# Altium schematic sheet Oscillating.SchDoc
size A3
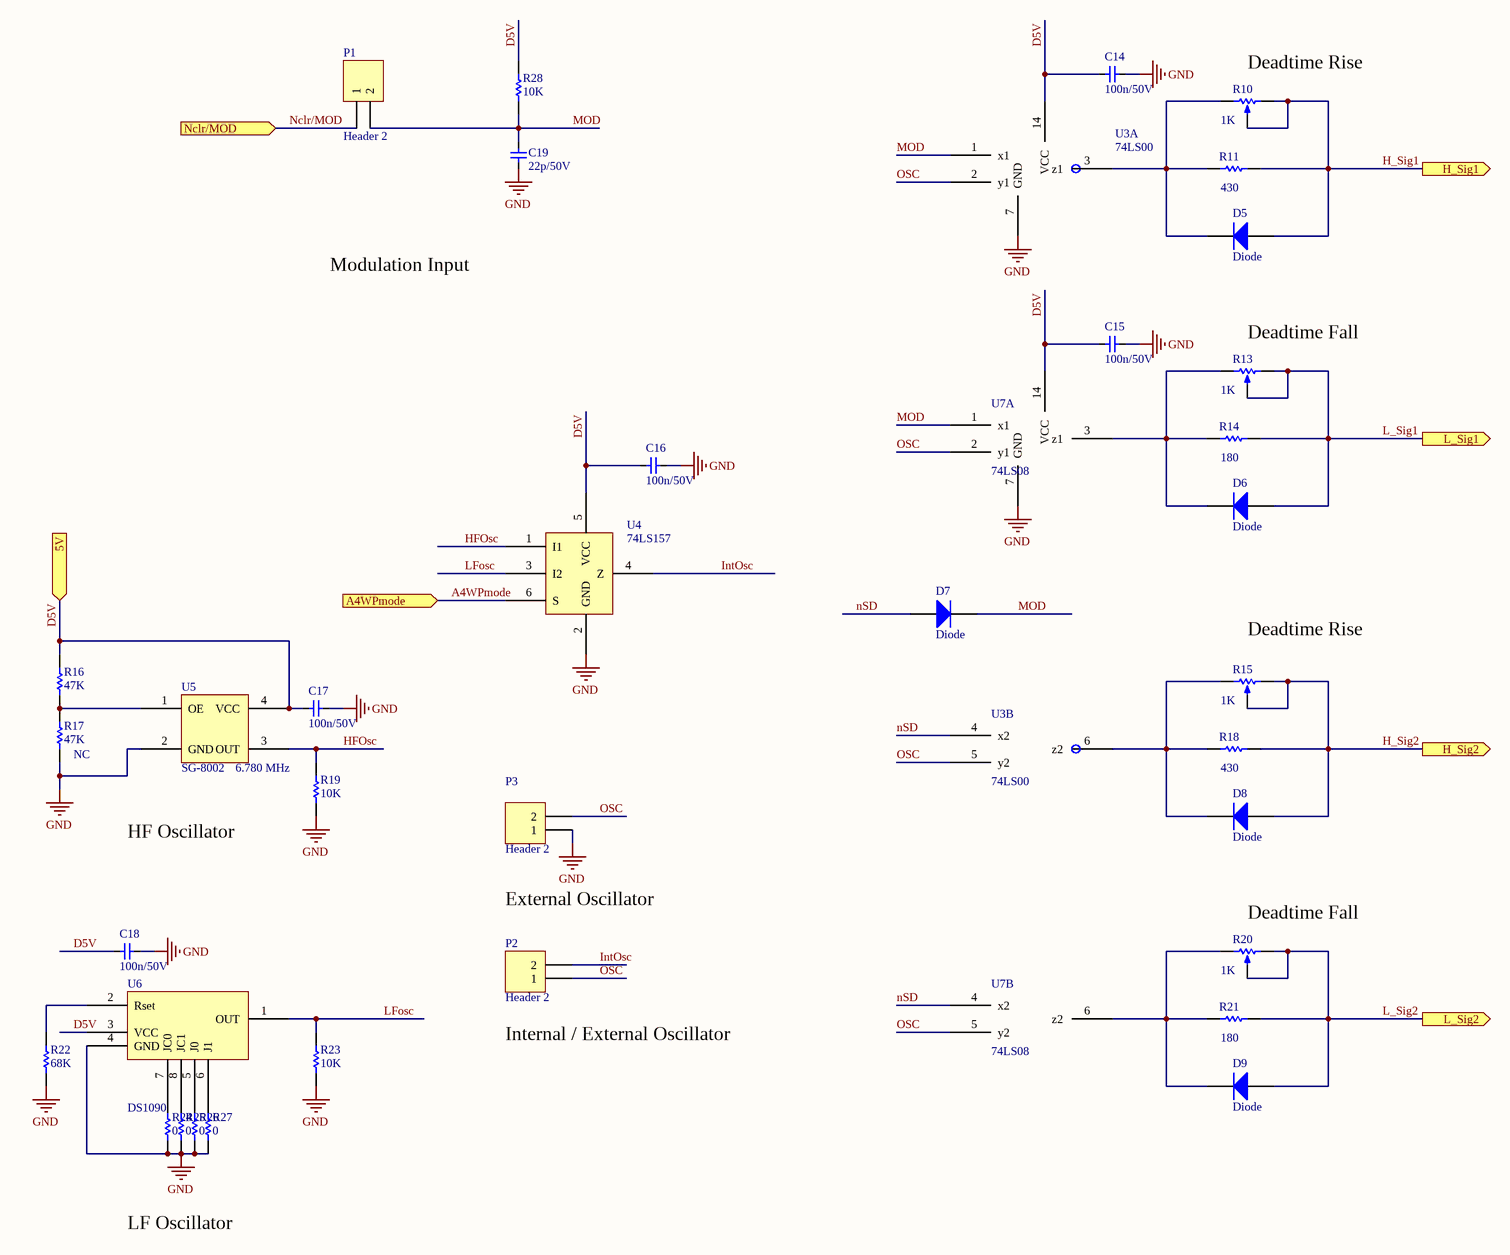
[diagram p0: Oscillating.SchDoc]

## Parts
C14  100n/50V  [0603]
C15  100n/50V  [0603]
C16  100n/50V  [0603]
C17  100n/50V  [0603]
C18  100n/50V  [0603]
C19  22p/50V  [0603]
D5  Diode  [SMA]
D6  Diode  [SMA]
D7  Diode  [SMA]
D8  Diode  [SMA]
D9  Diode  [SMA]
P1  Header 2  [HDR1X2]
P2  Header 2  [HDR1X2]
P3  Header 2  [HDR1X2]
R10  value 1K  [VR5]  (hidden comment: RPot)
R11  value 430  [0603]
R13  value 1K  [VR5]  (hidden comment: RPot)
R14  value 180  [0603]
R15  value 1K  [VR5]  (hidden comment: RPot)
R16  value 47K  [0603]  (hidden comment: Res1)
R17  NC  value 47K  [0603]
R18  value 430  [0603]
R19  value 10K  [0603]  (hidden comment: Res1)
R20  value 1K  [VR5]  (hidden comment: RPot)
R21  value 180  [0603]
R22  value 68K  [0603]
R23  value 10K  [0603]  (hidden comment: Res1)
R24  value 0  [0603]
R25  value 0  [0603]
R26  value 0  [0603]
R27  value 0  [0603]
R28  value 10K  [0603]  (hidden comment: Res1)
U3  74LS00  [SO-14]  (parts A,B of 4)
U4  74LS157  [TSOP65P220X100-6N]
U5  SG-8002  value 6.780 MHz  [SOT192P240X120-4N]
U6  DS1090  [TSOP65P490X100-8N]
U7  74LS08  [SO-14]  (parts A,B of 4)

## Ports
5V (in), A4WPmode (in), H_Sig1 (out), H_Sig2 (out), L_Sig1 (out), L_Sig2 (out), Nclr/MOD (in)

## Nets
GND: C14.1 C15.1 C16.1 C17.1 C18.1 C19.2 P3.1 R17.1 R19.1 R22.1 R23.1 R24.1 R25.1 R26.1 R27.1 U3.7(GND) U4.2(GND) U5.2(GND) U6.4(GND) U7.7(GND)
A4WPmode: U4.6(S) ; port A4WPmode
D5V: C14.2 C15.2 C16.2 C17.2 C18.2 R16.2 R28.2 U3.14(VCC) U4.5(VCC) U5.4(VCC) U6.3(VCC) U7.14(VCC) ; port 5V
H_Sig1: D5.1(A) R10.2(BOT) R10.3(TAP) R11.1 ; port H_Sig1
H_Sig2: D8.1(A) R15.2(BOT) R15.3(TAP) R18.1 ; port H_Sig2
HFOsc: R19.2 U4.1(I1) U5.3(OUT)
IntOsc: P2.2 U4.4(Z)
L_Sig1: D6.1(A) R13.2(BOT) R13.3(TAP) R14.1 ; port L_Sig1
L_Sig2: D9.1(A) R20.2(BOT) R20.3(TAP) R21.1 ; port L_Sig2
LFosc: R23.2 U4.3(I2) U6.1(OUT)
MOD: C19.1 D7.2(K) P1.2 R28.1 U3.1(x1) U7.1(x1)
Nclr/MOD: P1.1 ; port Nclr/MOD
nSD: D7.1(A) U3.4(x2) U7.4(x2)
OSC: P2.1 P3.2 U3.2(y1) U3.5(y2) U7.2(y1) U7.5(y2)
NetD5_2: D5.2(K) R10.1(TOP) R11.2 U3.3(z1)
NetD6_2: D6.2(K) R13.1(TOP) R14.2 U7.3(z1)
NetD8_2: D8.2(K) R15.1(TOP) R18.2 U3.6(z2)
NetD9_2: D9.2(K) R20.1(TOP) R21.2 U7.6(z2)
NetR16_1: R16.1 R17.2 U5.1(OE)
NetR22_2: R22.2 U6.2(Rset)
NetR24_2: R24.2 U6.7(JC0)
NetR25_2: R25.2 U6.8(JC1)
NetR26_2: R26.2 U6.5(J0)
NetR27_2: R27.2 U6.6(J1)

## Notes on the sheet
- (near R10) Deadtime Rise
- Modulation Input
- (near R13) Deadtime Fall
- (near R15) Deadtime Rise
- HF Oscillator
- External Oscillator
- (near R20) Deadtime Fall
- (near P2) Internal / External Oscillator
- LF Oscillator

## Library data of the parts
C14-C19 = CAP1: Capacitor
D5-D9 = Diode: Default Diode; Published: 8-Jun-2000; LatestRevisionDate: 17-Jul-2002; LatestRevisionNote: Re-released for DXP Platform.; PackageVersion: Sep-1996; PackageReference: SMC; Publisher: Altium Limited; PackageDescription: DO-214-AB/SMC; 2 C-Bend Leads; Body 7.9 x 5.9 mm, inc. leads (LxW); Code_JEDEC: DO-214-AB
P1-P3 = Header 2: Header, 2-Pin; LatestRevisionDate: 17-Jul-2002; LatestRevisionNote: Re-released for DXP Platform.; Publisher: Altium Limited
R10 R13 R15 R20 = RPot: Potentiometer; Sim Note: Enter the Resistance value and the set point into parameter fields.; Set Position: 0.5; Published: 8-Jun-2000; LatestRevisionDate: 17-Jul-2002; LatestRevisionNote: Re-released for DXP Platform.; PackageReference: VR5; Publisher: Altium Limited; PackageDescription: Variable Resistor, Thru-Hole; 3 Leads
R11 R14 R16-R19 R21-R28 = Res1: Resistor; Published: 8-Jun-2000; LatestRevisionDate: 17-Jul-2002; LatestRevisionNote: Re-released for DXP Platform.; PackageReference: AXIAL-0.3; Publisher: Altium Limited; PackageDescription: Axial Device, Thru-Hole; 2 Leads; 0.3 in Pin Spacing